# Altium schematic sheet EXPENSION.SchDoc
size A; SheetNumber: 5; SheetTotal: 6
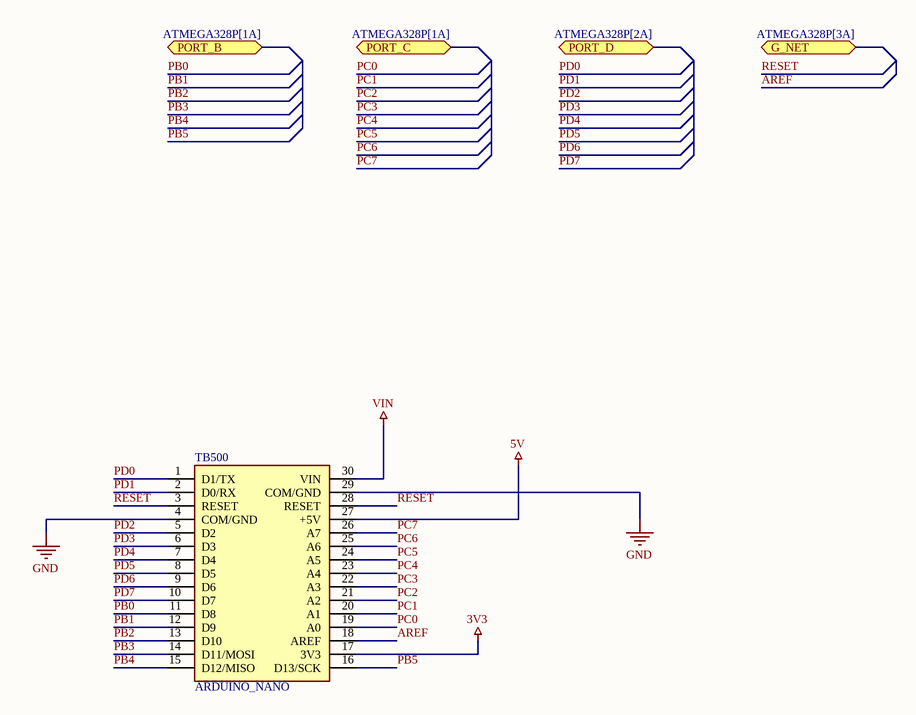
[diagram p0: EXPENSION.SchDoc]

## Parts
TB500  ARDUINO_NANO  [SHIELD_ARDUINO_NANO]

## Ports
G_NET (bidir, see ATMEGA328P[3A]), PORT_B (bidir, see ATMEGA328P[1A]), PORT_C (bidir, see ATMEGA328P[1A]), PORT_D (bidir, see ATMEGA328P[2A])

## Nets
3V3: TB500.17(3V3)
5V: TB500.27(+5V)
GND: TB500.4(COM/GND) TB500.29(COM/GND)
VIN: TB500.30(VIN)
AREF: TB500.18(AREF)
PB0: TB500.11(D8)
PB1: TB500.12(D9)
PB2: TB500.13(D10)
PB3: TB500.14(D11/MOSI)
PB4: TB500.15(D12/MISO)
PB5: TB500.16(D13/SCK)
PC0: TB500.19(A0)
PC1: TB500.20(A1)
PC2: TB500.21(A2)
PC3: TB500.22(A3)
PC4: TB500.23(A4)
PC5: TB500.24(A5)
PC6: TB500.25(A6)
PC7: TB500.26(A7)
PD0: TB500.1(D1/TX)
PD1: TB500.2(D0/RX)
PD2: TB500.5(D2)
PD3: TB500.6(D3)
PD4: TB500.7(D4)
PD5: TB500.8(D5)
PD6: TB500.9(D6)
PD7: TB500.10(D7)
RESET: TB500.3(RESET) TB500.28(RESET)

## Library data of the parts
TB500 = ARDUINO_NANO: Small, complete, and breadboard-friendly board based on the ATmega328 (Arduino Nano 3.x); MF: Arduino; SnapEDA_Link: https://www.snapeda.com/parts/Arduino%20Nano/Arduino/view-part/?ref=snap; Package: Non-Standard Arduino; Price: None; Availability: Not in stock; Value: *; Check_prices: https://www.snapeda.com/parts/Arduino%20Nano/Arduino/view-part/?ref=eda; MP: Arduino Nano